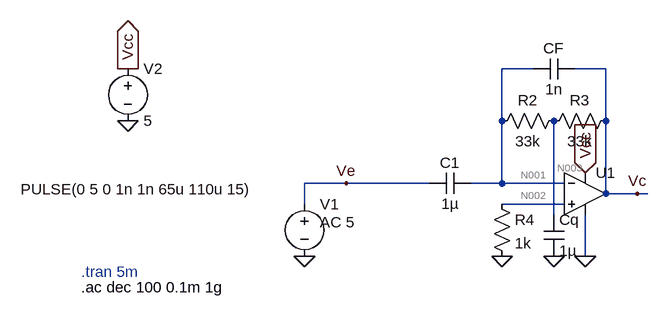
[diagram p0: schematic filtre_biz.asc]
filtre_biz.asc, the LTspice schematic file:
Version 4
SHEET 1 1076 680
WIRE 496 -80 448 -80
WIRE 608 -80 560 -80
WIRE 448 0 448 -80
WIRE 608 0 608 -80
WIRE 208 96 144 96
WIRE 336 96 208 96
WIRE 448 96 448 0
WIRE 448 96 400 96
WIRE 544 96 448 96
WIRE 608 112 608 0
WIRE 656 112 608 112
WIRE 672 112 656 112
WIRE 144 128 144 96
WIRE 544 128 448 128
WIRE 528 144 528 0
WIRE 576 208 576 144
FLAG 144 208 0
FLAG 448 208 0
FLAG 528 208 0
FLAG 576 208 0
FLAG 576 80 Vcc
IOPIN 576 80 In
FLAG -128 0 0
FLAG -128 -80 Vcc
IOPIN -128 -80 Out
FLAG 656 112 Vc
FLAG 208 96 Ve
SYMBOL voltage 144 112 R0
WINDOW 3 -437 -7 Left 2
WINDOW 123 24 44 Left 2
WINDOW 39 0 0 Left 2
SYMATTR Value PULSE(0 5 0 1n 1n 65u 110u 15)
SYMATTR Value2 AC 5
SYMATTR InstName V1
SYMBOL cap 400 80 R90
WINDOW 0 0 32 VBottom 2
WINDOW 3 32 32 VTop 2
SYMATTR InstName C1
SYMATTR Value 1µ
SYMBOL res 544 -16 R90
WINDOW 0 0 56 VBottom 2
WINDOW 3 32 56 VTop 2
SYMATTR InstName R2
SYMATTR Value 33k
SYMBOL res 624 -16 R90
WINDOW 0 0 56 VBottom 2
WINDOW 3 32 56 VTop 2
SYMATTR InstName R3
SYMATTR Value 33k
SYMBOL cap 560 -96 R90
WINDOW 0 0 32 VBottom 2
WINDOW 3 32 32 VTop 2
SYMATTR InstName CF
SYMATTR Value 1n
SYMBOL cap 512 144 R0
SYMATTR InstName Cq
SYMATTR Value 1µ
SYMBOL Opamps\\UniversalOpamp2 576 112 R0
SYMATTR InstName U1
SYMBOL voltage -128 -96 R0
WINDOW 123 0 0 Left 2
WINDOW 39 0 0 Left 2
SYMATTR InstName V2
SYMATTR Value 5
SYMBOL res 432 112 R0
SYMATTR InstName R4
SYMATTR Value 1k
TEXT -200 232 Left 2 ;.tran 5m
TEXT -200 256 Left 2 !.ac dec 100 0.1m 1g

The netlist it stands for:
* filtre_biz.asc
V1 Ve 0 PULSE(0 5 0 1n 1n 65u 110u 15) AC 5
C1 N001 Ve 1µ
R2 N003 N001 33k
R3 Vc N003 33k
CF Vc N001 1n
Cq N003 0 1µ
XU1 N002 N001 Vcc 0 Vc level.2 Avol=1Meg GBW=10Meg Slew=10Meg ilimit=25m rail=0 Vos=0 phimargin=45 en=0 enk=0 in=0 ink=0 Rin=500Meg  ; pins IN+ IN- V+ V- OUT
V2 Vcc 0 5
R4 N002 0 1k
* .tran 5m
.ac dec 100 0.1m 1g
.lib UniversalOpamps2.sub
.backanno
.end

* Results of the author's LTspice run, read from the files saved beside the schematic
* Operating Point, zero values left out:
*   V(n001) = 3.452 mV
*   V(n003) = 3.287 mV
*   V(vc) = 3.123 mV
*   V(vcc) = 5 V
*   V(n002) = 5 µV
*   I(R4) = 5 nA
*   I(R3) = -4.993 nA
*   I(R2) = -4.993 nA
*   I(V2) = -12.52 µA
*   Ix(u1:1) = -5 nA
*   Ix(u1:2) = -4.993 nA
*   Ix(u1:3) = 12.52 µA
*   Ix(u1:4) = -12.49 µA
*   Ix(u1:5) = 4.993 nA
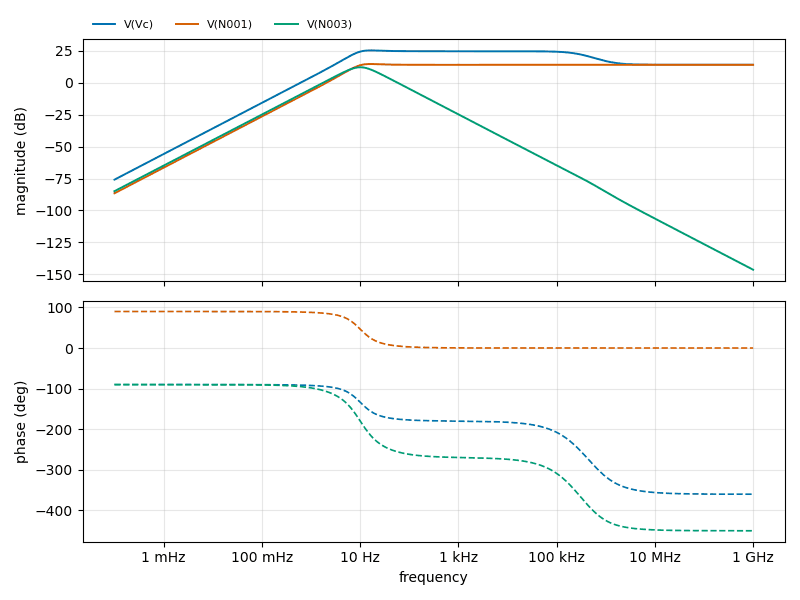
[diagram p1: AC Analysis of filtre_biz.asc, plotted from the saved traces]
* AC Analysis, 1 run:
*   V(Vc): -75.90 dB at 100 µHz, 13.96 dB at 1 GHz, peak 25.23 dB at 16.6 Hz, 3 dB below the peak at 7.306 Hz and 293.6 kHz
*   V(N001): -86.56 dB at 100 µHz, 13.98 dB at 1 GHz, peak 14.58 dB at 16.6 Hz, 3 dB below the peak at 7.313 Hz
*   V(N003): -84.93 dB at 100 µHz, -146.34 dB at 1 GHz, peak 12.05 dB at 10 Hz, 3 dB below the peak at 5.194 Hz and 19.61 Hz